# Altium schematic sheet OpAmp.SchDoc
size A4; CompanyName: TH Nürnberg; Organization: UltraZohm; Address1: Kesslerplatz 12; Address2: 90489 Nürnberg; Address3: GERMANY; SheetNumber: 4; SheetTotal: 10
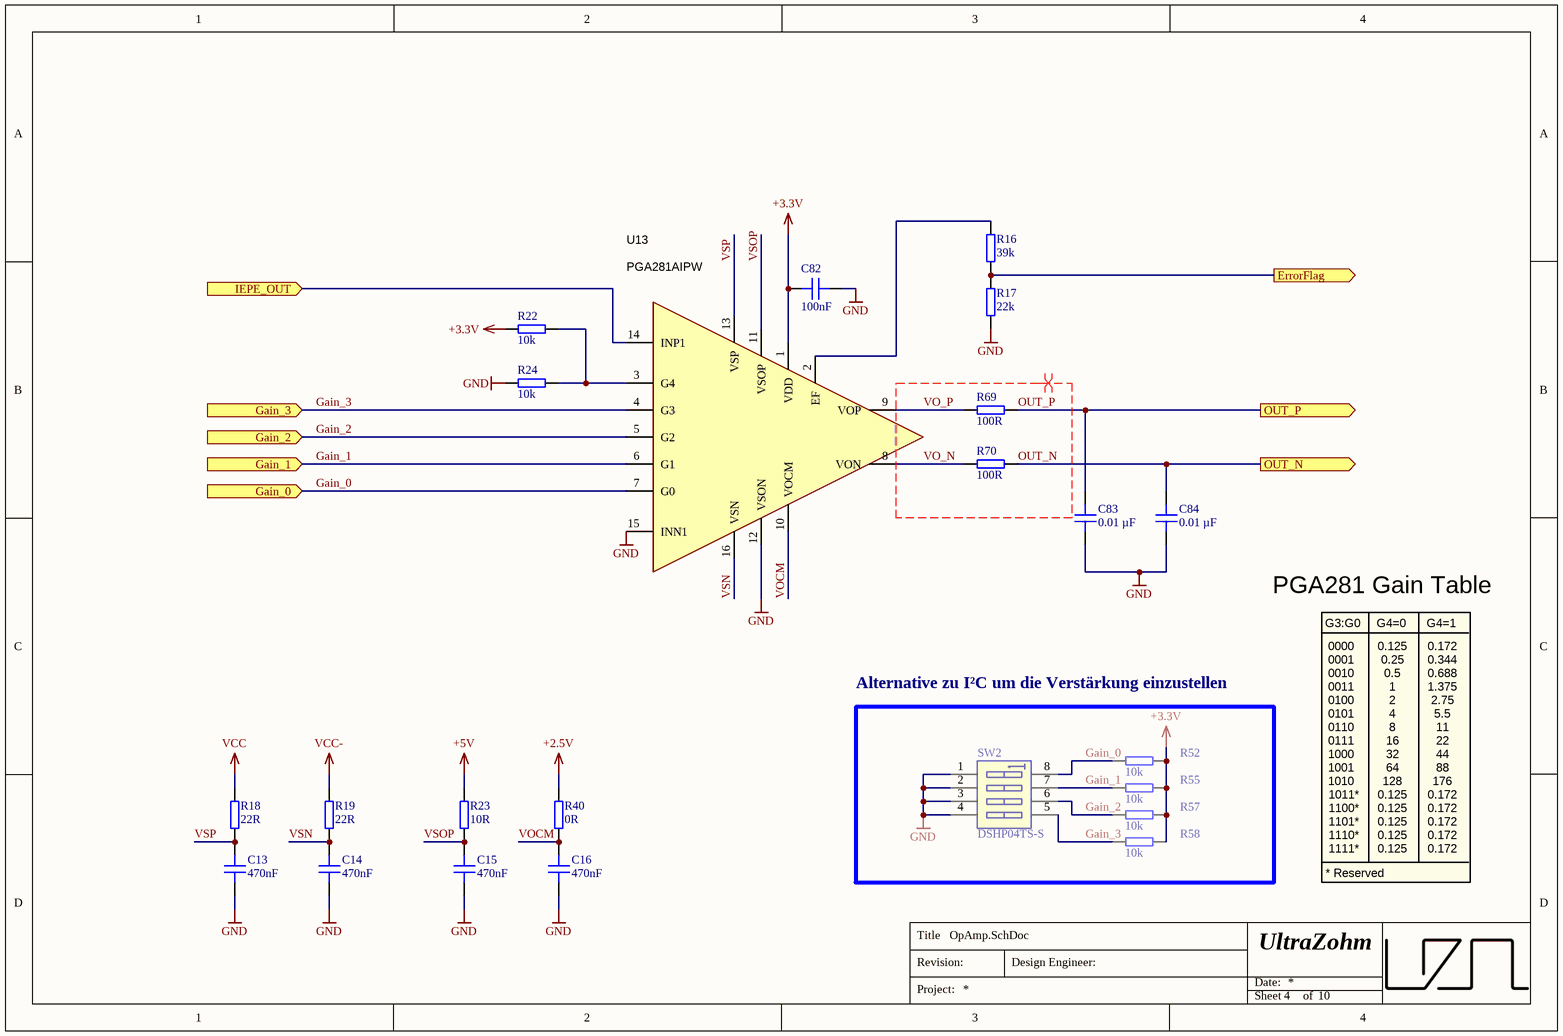
[diagram p0: OpAmp.SchDoc]

## Parts
C13  470nF  [C_0603]
C14  470nF  [C_0603]
C15  470nF  [C_0603]
C16  470nF  [C_0603]
C82  100nF  [C_0603]
C83  0.01 µF  [C_0603]
C84  0.01 µF  [C_0603]
R16  39k  [RES 0603_1608]
R17  22k  [RES 0603_1608]
R18  22R  [RES 0603_1608]
R19  22R  [RES 0603_1608]
R22  10k  [RES 0603_1608]
R23  10R  [RES 0603_1608]
R24  10k  [RES 0603_1608]
R40  0R  [RES 0603_1608]
R52  10k  [RES 0603_1608]
R55  10k  [RES 0603_1608]
R57  10k  [RES 0603_1608]
R58  10k  [RES 0603_1608]
R69  100R  [RES 0603_1608]
R70  100R  [RES 0603_1608]
SW2  DSHP04TS-S  [416131160804]
U13  PGA281AIPW  [PW0016A_N]

## Blocks framed on the sheet
Alternative zu I²C um die Verstärkung einzustellen: R52 R55 R57 R58 SW2

## Ports
ErrorFlag (out), Gain_0 (in), Gain_1 (in), Gain_2 (in), Gain_3 (in), IEPE_OUT (in), OUT_N (out), OUT_P (out)

## Nets
+2.5V: R40.2
+3.3V: C82.2 R22.1 R52.1 R55.1 R57.1 R58.1 U13.1(VDD)
+5V: R23.2
GND: C13.1 C14.1 C15.1 C16.1 C82.1 C83.1 C84.1 R17.1 R24.1 SW2.1 SW2.2 SW2.3 SW2.4 U13.12(VSON) U13.15(INN1)
VCC: R18.2
VCC-: R19.2
ErrorFlag: R16.1 R17.2 ; port ErrorFlag
Gain_0: R52.2 SW2.8 U13.7(G0) ; port Gain_0
Gain_1: R55.2 SW2.7 U13.6(G1) ; port Gain_1
Gain_2: R57.2 SW2.6 U13.5(G2) ; port Gain_2
Gain_3: R58.2 SW2.5 U13.4(G3) ; port Gain_3
IEPE_OUT: U13.14(INP1) ; port IEPE_OUT
OUT_N: C84.2 R70.2 ; port OUT_N
OUT_P: C83.2 R69.2 ; port OUT_P
VO_N: R70.1 U13.8(VON)
VO_P: R69.1 U13.9(VOP)
VOCM: C16.2 R40.1 U13.10(VOCM)
VSN: C14.2 R19.1 U13.16(VSN)
VSOP: C15.2 R23.1 U13.11(VSOP)
VSP: C13.2 R18.1 U13.13(VSP)
NetR16_2: R16.2 U13.2(EF)
NetR22_2: R22.2 R24.2 U13.3(G4)

## Layout directives
differential pair: OUT_N, OUT_P, VO_N, VO_P

## Notes on the sheet
- PGA281 Gain Table
- 0000
- 0001
- G3:G0
- G4=0
- 0.125
- 0.25
- G4=1
- 0.172
- 0.344
- 0010
- 0011
- 0100
- 0101
- 0.5
- 1
- 2
- 4
- 0.688
- 1.375
- 2.75
- 5.5
- 0110
- 0111
- 1000
- 1001
- 1010
- 1011*
- 8
- 16
- 32
- 64
- 128
- 11
- 22
- 44
- 88
- 176
- 1100*
- 1101*
- 1110*
- 1111*
- * Reserved
- Title
- Revision:
- Design Engineer:
- Date:
- Project:
- Sheet
- of

## Library data of the parts
C13-C16 C82 = C0603C104J3REC7411: Capacitor 0603, 25 VDC, 0.1 µF, X7R; Manufacturer Part Number: C0603C104J3REC7411
C83 C84 = GCJ188R71H103KA01D: Capacitor 0603, 50 VDC, 0.01 µF, X7R; Manufacturer: muRata; Tolerance: 10 %; Voltage Rating: 50 VDC; Created from: MGremer; Manufacturer Part Number: GCJ188R71H103KA01D; PartID: 1; Created On: 20.12.2020 13:54:13; ComponentLink1Description: Datasheet; ComponentLink1URL: https://www.mouser.de/datasheet/2/281/c03e-516224.pdf; Component Type: Capacitor 0603; Device Package: 0603; Last Updated: 20.12.2020 16:24:16; Mounting Type: SMD; Operating Temperature: -55 - 125°C; Series: GCJ; Supplier 1: Mouser; Supplier Part Number 1: 81-GCJ188R71H103KA1D; Type: Capacitor; Value: 0.01 µF; Live Cycle Status: 1; Stock number: Labor SMD Container
R16 = RK73B1JTTDD393J: SMD resistor E24 series; Manufacturer: KOA Speer; Tolerance: 5%; Created from: MGremer; Manufacturer Part Number: RK73B1JTTDD393J; PartID: 112; Created On: 14.12.2020 16:17:14; ComponentLink1Description: Datasheet; ComponentLink1URL: https://www.mouser.de/datasheet/2/219/RK73B-1825463.pdf; Component Type: SMD resistor; Device Package: 0603; Last Updated: 02.03.2021 14:07:32; Mounting Type: SMD; Supplier 1: Mouser; Supplier Part Number 1: 660-RK73B1JTTDD393J; Type: Resistor; Value: 39k; Live Cycle Status: 1; Stock number: Labor SMD Container
R17 = RK73B1JTTD223J: SMD resistor E24 series; Manufacturer: KOA Speer; Tolerance: 5%; Created from: MGremer; Manufacturer Part Number: RK73B1JTTD223J; PartID: 106; Created On: 14.12.2020 16:17:14; ComponentLink1Description: Datasheet; ComponentLink1URL: https://www.mouser.de/datasheet/2/219/RK73B-1825463.pdf; Component Type: SMD resistor; Device Package: 0603; Last Updated: 02.03.2021 14:07:32; Mounting Type: SMD; Supplier 1: Mouser; Supplier Part Number 1: 660-RK73B1JTTD223J; Type: Resistor; Value: 22k; Live Cycle Status: 1; Stock number: Labor SMD Container
R18 R19 R23 = RC0603JR-070RL: SMD resistor E24 series; Manufacturer Part Number: RC0603JR-070RL
R22 R24 R52 R55 R57 R58 = RK73B1JTTD103J: SMD resistor E24 series; Manufacturer: KOA Speer; Tolerance: 5%; Created from: MGremer; Manufacturer Part Number: RK73B1JTTD103J; PartID: 98; Created On: 14.12.2020 16:17:14; ComponentLink1Description: Datasheet; ComponentLink1URL: https://www.mouser.de/datasheet/2/219/RK73B-1825463.pdf; Component Type: SMD resistor; Device Package: 0603; Last Updated: 02.03.2021 14:07:32; Mounting Type: SMD; Supplier 1: Mouser; Supplier Part Number 1: 660-RK73B1JTTD103J; Type: Resistor; Value: 10k; Live Cycle Status: 1; Stock number: Labor SMD Container
R40 = RC0603JR-070RL: SMD resistor E24 series; Manufacturer: YAGEO; Tolerance: 5%; Created from: MGremer; Manufacturer Part Number: RC0603JR-070RL; PartID: 1; Created On: 14.12.2020 16:17:14; ComponentLink1Description: Datasheet; ComponentLink1URL: https://www.mouser.de/datasheet/2/447/PYu-RC_Group_51_RoHS_L_10-1664068.pdf; Component Type: SMD resistor; Device Package: 0603; Last Updated: 04.03.2021 09:09:42; Mounting Type: SMD; Supplier 1: Mouser; Supplier Part Number 1: 603-RC0603JR-070RL; Supplier 2: LCSC; Supplier Part Number 2: C21189; Type: Resistor; Value: 0R; Live Cycle Status: 1; Stock number: Labor SMD Container; LCSC Part Number: C21189
R69 R70 = RK73B1JTTD101J: SMD resistor E24 series; Manufacturer: KOA Speer; Tolerance: 5%; Created from: MGremer; Manufacturer Part Number: RK73B1JTTD101J; PartID: 50; Created On: 14.12.2020 16:17:14; ComponentLink1Description: Datasheet; ComponentLink1URL: https://www.mouser.de/datasheet/2/219/RK73B-1825463.pdf; Component Type: SMD resistor; Device Package: 0603; Last Updated: 02.03.2021 14:07:32; Mounting Type: SMD; Supplier 1: Mouser; Supplier Part Number 1: 660-RK73B1JTTD101J; Type: Resistor; Value: 100R; Live Cycle Status: 1; Stock number: Labor SMD Container
SW2 = DSHP04TS-S: 04p, 1.27mm Pitch, Horizontal, HP Type, SMT, flat Actuator, black, with Tape, T&R; Manufacturer: XKB Connectivity; Created from: T. Wendt; Manufacturer Part Number: DSHP04TS-S; PartID: 6; Created On: 02.03.2021 14:59:37; ComponentLink1Description: Datasheet; ComponentLink1URL: https://datasheet.lcsc.com/szlcsc/1912111437_XKB-Connectivity-DSHP04TS-S_C319050.pdf; Component Type: DIP-Switch; Device Package: DIP; Last Updated: 02.03.2021 14:59:37; Minimum Order: 1; Mounting Type: SMD; Supplier 1: LCSC; Supplier Part Number 1: C319050; Type: DIP-Switch; Live Cycle Status: 1; LCSC Part Number: C319050; Stock number: not stored
U13 = PGA281AIPW: Precision,Zero-Drift,High-Voltage,Programmable Gain Instrumentation Amplifier; Manufacturer: Texas Instruments; PartNumber: Used in BOM report; SymbolVersion: use current date i.e. 2008-05-20; SymbolCreator: Use a-id; CompType: Used in some BOM reports.  Useful for finding later.; U/M: EA, IN, or GM; Created from: PTurowski; MountType: SMT, TH, or N/A; RoHS: Used in BOM report.  Use Y or N.; PackageReference: eg:  0603, used in PnP report; ComponentLink1Description: Datasheet; ComponentLink1URL: https://www.ti.com/lit/ds/symlink/pga281.pdf?HQS=dis-mous-null-mousermode-dsf-pf-null-wwe&ts=1621241302298; Alternate PartNumber: -; Alternate Manufacturer: -; Manufacturer Part Number: PGA281AIPW; PartID: 6; Created On: 25.05.2021 11:50:21; Component Type: Operational Amplifier; Last Updated: 23.08.2021 10:37:27; Mounting Type: SMD/SMT; Operating Temperature: -40 - 125°C; Supplier 1: Mouser; Supplier Part Number 1: 595-PGA281AIPW; Type: OPAMP; Live Cycle Status: 1; Stock number: not stored